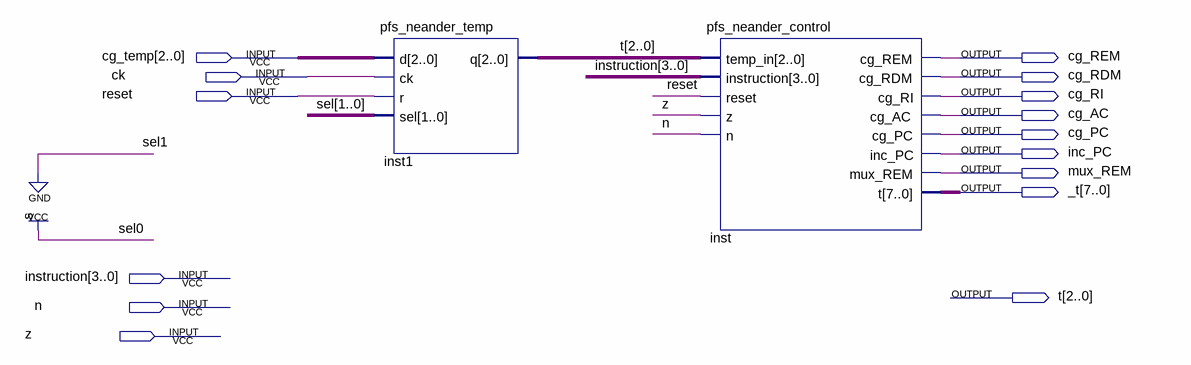
[diagram p0: schematic sheet]
// Quartus schematic pfs_neander_full_control.bdf as structural Verilog: 2 symbols, 15 pins
module pfs_neander_full_control (
  input  [2:0] cg_temp,
  input  ck,
  input  reset,
  input  [3:0] instruction,
  input  n,
  input  z,
  output cg_REM,
  output cg_RDM,
  output cg_RI,
  output cg_AC,
  output cg_PC,
  output inc_PC,
  output mux_REM,
  output [7:0] _t,
  output [2:0] t
);

  pfs_neander_temp inst1 (.d(cg_temp), .ck(ck), .r(reset), .sel(2'b01), .q(t));
  pfs_neander_control inst (
    .temp_in(t), .instruction(instruction), .reset(reset), .z(z), .n(n), .cg_REM(cg_REM), .cg_RDM(cg_RDM),
    .cg_RI(cg_RI), .cg_AC(cg_AC), .cg_PC(cg_PC), .inc_PC(inc_PC), .mux_REM(mux_REM), .t(_t));
endmodule
